# EAGLE design Protoboard MX2-8-7 (EAGLE 7.7.0)
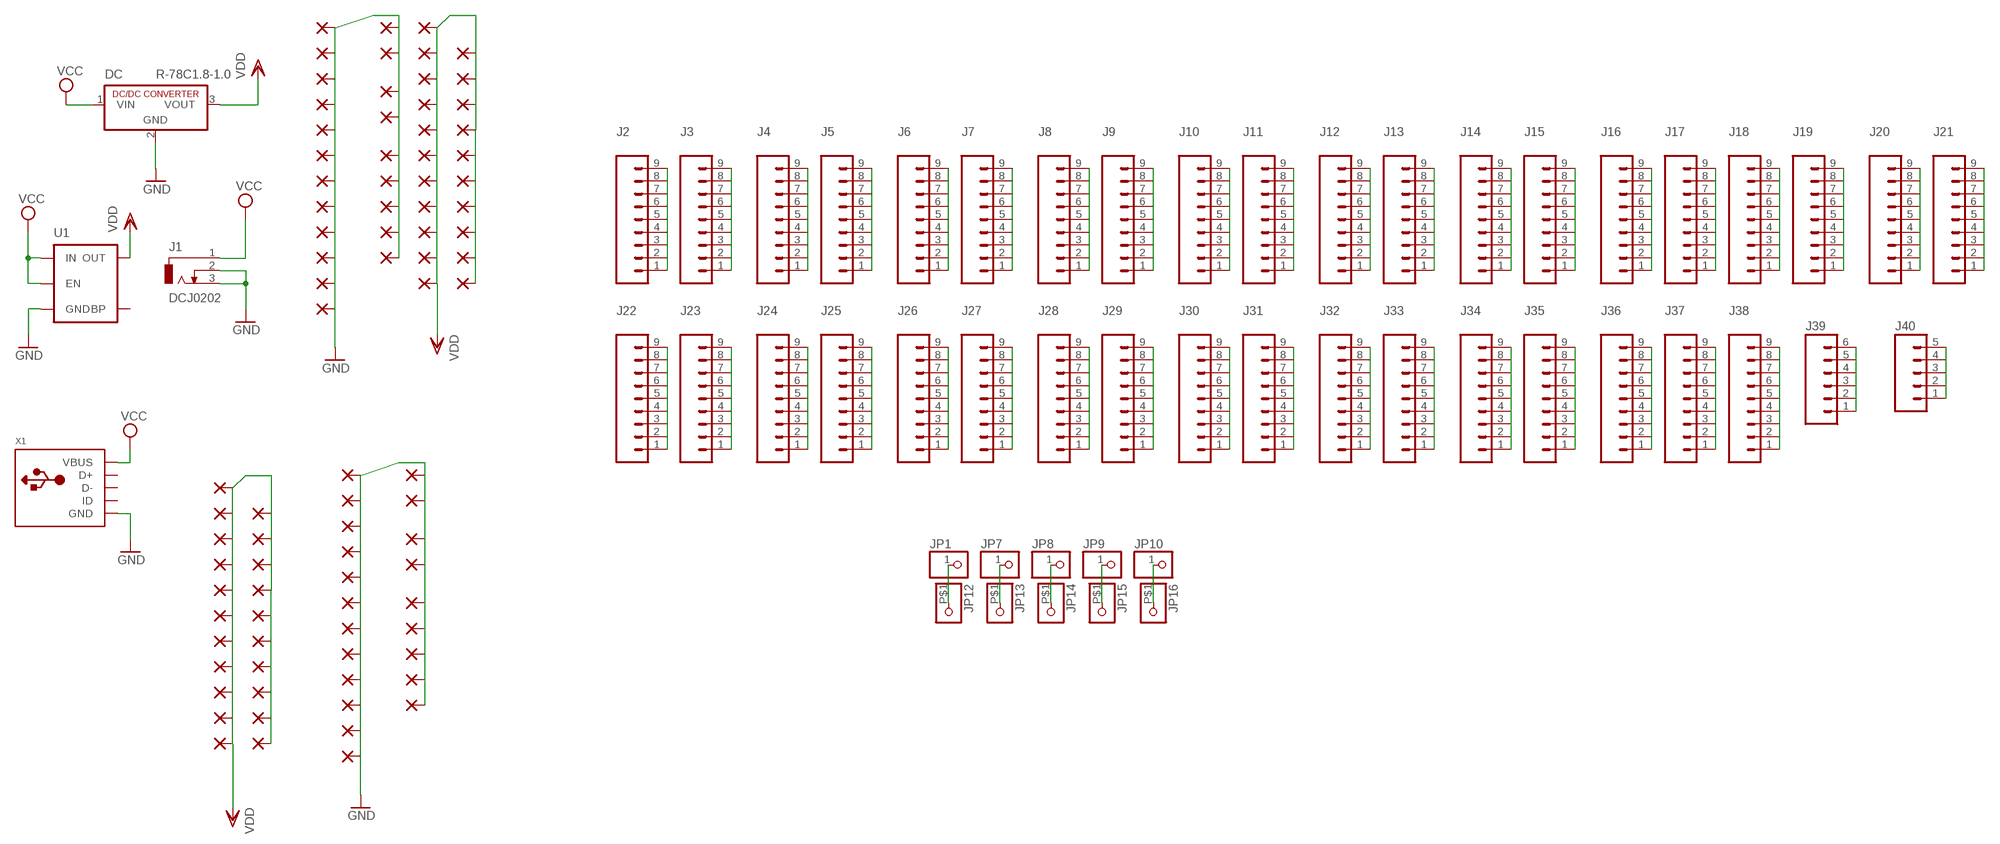
[diagram p0: schematic, sheet 1]

## Parts
DC  R-78C1.8-1.0  [SIP3]
J1  DCJ0202  [DCJ0202]
J2  M09NO_SILK  [1X09_NO_SILK]
J3  M09NO_SILK  [1X09_NO_SILK]
J4  M09NO_SILK  [1X09_NO_SILK]
J5  M09NO_SILK  [1X09_NO_SILK]
J6  M09NO_SILK  [1X09_NO_SILK]
J7  M09NO_SILK  [1X09_NO_SILK]
J8  M09NO_SILK  [1X09_NO_SILK]
J9  M09NO_SILK  [1X09_NO_SILK]
J10  M09NO_SILK  [1X09_NO_SILK]
J11  M09NO_SILK  [1X09_NO_SILK]
J12  M09NO_SILK  [1X09_NO_SILK]
J13  M09NO_SILK  [1X09_NO_SILK]
J14  M09NO_SILK  [1X09_NO_SILK]
J15  M09NO_SILK  [1X09_NO_SILK]
J16  M09NO_SILK  [1X09_NO_SILK]
J17  M09NO_SILK  [1X09_NO_SILK]
J18  M09NO_SILK  [1X09_NO_SILK]
J19  M09NO_SILK  [1X09_NO_SILK]
J20  M09NO_SILK  [1X09_NO_SILK]
J21  M09NO_SILK  [1X09_NO_SILK]
J22  M09NO_SILK  [1X09_NO_SILK]
J23  M09NO_SILK  [1X09_NO_SILK]
J24  M09NO_SILK  [1X09_NO_SILK]
J25  M09NO_SILK  [1X09_NO_SILK]
J26  M09NO_SILK  [1X09_NO_SILK]
J27  M09NO_SILK  [1X09_NO_SILK]
J28  M09NO_SILK  [1X09_NO_SILK]
J29  M09NO_SILK  [1X09_NO_SILK]
J30  M09NO_SILK  [1X09_NO_SILK]
J31  M09NO_SILK  [1X09_NO_SILK]
J32  M09NO_SILK  [1X09_NO_SILK]
J33  M09NO_SILK  [1X09_NO_SILK]
J34  M09NO_SILK  [1X09_NO_SILK]
J35  M09NO_SILK  [1X09_NO_SILK]
J36  M09NO_SILK  [1X09_NO_SILK]
J37  M09NO_SILK  [1X09_NO_SILK]
J38  M09NO_SILK  [1X09_NO_SILK]
J39  M06NO_SILK_FEMALE_PTH  [1X06_NO_SILK]
J40  M05NO_SILK  [1X05_NO_SILK]
JP1  PINHD-1X1CB  [1X01-CLEANBIG]
JP7  PINHD-1X1CB  [1X01-CLEANBIG]
JP8  PINHD-1X1CB  [1X01-CLEANBIG]
JP9  PINHD-1X1CB  [1X01-CLEANBIG]
JP10  PINHD-1X1CB  [1X01-CLEANBIG]
JP12  PINHD-1X1-BIGPOGO  [1X1-BIGPOGO]
JP13  PINHD-1X1-BIGPOGO  [1X1-BIGPOGO]
JP14  PINHD-1X1-BIGPOGO  [1X1-BIGPOGO]
JP15  PINHD-1X1-BIGPOGO  [1X1-BIGPOGO]
JP16  PINHD-1X1-BIGPOGO  [1X1-BIGPOGO]
PAD1  1,6/0,8  [1,6/0,8]
PAD2  1,6/0,8  [1,6/0,8]
PAD3  1,6/0,8  [1,6/0,8]
PAD4  1,6/0,8  [1,6/0,8]
PAD5  1,6/0,8  [1,6/0,8]
PAD6  1,6/0,8  [1,6/0,8]
PAD7  1,6/0,8  [1,6/0,8]
PAD8  1,6/0,8  [1,6/0,8]
PAD9  1,6/0,8  [1,6/0,8]
PAD10  1,6/0,8  [1,6/0,8]
PAD11  1,6/0,8  [1,6/0,8]
PAD12  1,6/0,8  [1,6/0,8]
PAD13  1,6/0,8  [1,6/0,8]
PAD14  1,6/0,8  [1,6/0,8]
PAD15  1,6/0,8  [1,6/0,8]
PAD16  1,6/0,8  [1,6/0,8]
PAD17  1,6/0,8  [1,6/0,8]
PAD18  1,6/0,8  [1,6/0,8]
PAD19  1,6/0,8  [1,6/0,8]
PAD22  1,6/0,8  [1,6/0,8]
PAD23  1,6/0,8  [1,6/0,8]
PAD24  1,6/0,8  [1,6/0,8]
PAD25  1,6/0,8  [1,6/0,8]
PAD26  1,6/0,8  [1,6/0,8]
PAD27  1,6/0,8  [1,6/0,8]
PAD28  1,6/0,8  [1,6/0,8]
PAD29  1,6/0,8  [1,6/0,8]
PAD30  1,6/0,8  [1,6/0,8]
PAD31  1,6/0,8  [1,6/0,8]
PAD32  1,6/0,8  [1,6/0,8]
PAD33  1,6/0,8  [1,6/0,8]
PAD34  1,6/0,8  [1,6/0,8]
PAD35  1,6/0,8  [1,6/0,8]
PAD36  1,6/0,8  [1,6/0,8]
PAD37  1,6/0,8  [1,6/0,8]
PAD39  1,6/0,8  [1,6/0,8]
PAD40  1,6/0,8  [1,6/0,8]
PAD41  1,6/0,8  [1,6/0,8]
PAD43  1,6/0,8  [1,6/0,8]
PAD44  1,6/0,8  [1,6/0,8]
PAD45  1,6/0,8  [1,6/0,8]
PAD46  1,6/0,8  [1,6/0,8]
PAD421  1,6/0,8  [1,6/0,8]
PAD422  1,6/0,8  [1,6/0,8]
PAD423  1,6/0,8  [1,6/0,8]
PAD424  1,6/0,8  [1,6/0,8]
PAD425  1,6/0,8  [1,6/0,8]
PAD426  1,6/0,8  [1,6/0,8]
PAD427  1,6/0,8  [1,6/0,8]
PAD428  1,6/0,8  [1,6/0,8]
PAD429  1,6/0,8  [1,6/0,8]
PAD430  1,6/0,8  [1,6/0,8]
PAD431  1,6/0,8  [1,6/0,8]
PAD432  1,6/0,8  [1,6/0,8]
PAD433  1,6/0,8  [1,6/0,8]
PAD434  1,6/0,8  [1,6/0,8]
PAD435  1,6/0,8  [1,6/0,8]
PAD436  1,6/0,8  [1,6/0,8]
PAD437  1,6/0,8  [1,6/0,8]
PAD438  1,6/0,8  [1,6/0,8]
PAD439  1,6/0,8  [1,6/0,8]
PAD440  1,6/0,8  [1,6/0,8]
PAD441  1,6/0,8  [1,6/0,8]
PAD442  1,6/0,8  [1,6/0,8]
PAD443  1,6/0,8  [1,6/0,8]
PAD444  1,6/0,8  [1,6/0,8]
PAD445  1,6/0,8  [1,6/0,8]
PAD446  1,6/0,8  [1,6/0,8]
PAD447  1,6/0,8  [1,6/0,8]
PAD448  1,6/0,8  [1,6/0,8]
PAD449  1,6/0,8  [1,6/0,8]
PAD450  1,6/0,8  [1,6/0,8]
PAD451  1,6/0,8  [1,6/0,8]
PAD452  1,6/0,8  [1,6/0,8]
PAD453  1,6/0,8  [1,6/0,8]
PAD454  1,6/0,8  [1,6/0,8]
PAD455  1,6/0,8  [1,6/0,8]
PAD456  1,6/0,8  [1,6/0,8]
PAD457  1,6/0,8  [1,6/0,8]
PAD458  1,6/0,8  [1,6/0,8]
PAD459  1,6/0,8  [1,6/0,8]
PAD460  1,6/0,8  [1,6/0,8]
PAD461  1,6/0,8  [1,6/0,8]
PAD462  1,6/0,8  [1,6/0,8]
U1  MIC52053.3V  [SOT23-5]
X1  USB_MICRO_20329_V2  [4UCONN_20329_V2]

## Nets
GND: DC.2(GND) J1.2 J1.3 PAD1.1(P) PAD2.1(P) PAD3.1(P) PAD4.1(P) PAD5.1(P) PAD6.1(P) PAD7.1(P) PAD8.1(P) PAD9.1(P) PAD10.1(P) PAD11.1(P) PAD12.1(P) PAD13.1(P) PAD14.1(P) PAD16.1(P) PAD17.1(P) PAD18.1(P) PAD19.1(P) PAD22.1(P) PAD23.1(P) PAD24.1(P) PAD421.1(P) PAD422.1(P) PAD423.1(P) PAD424.1(P) PAD425.1(P) PAD426.1(P) PAD427.1(P) PAD428.1(P) PAD429.1(P) PAD430.1(P) PAD431.1(P) PAD432.1(P) PAD433.1(P) PAD434.1(P) PAD435.1(P) PAD436.1(P) PAD437.1(P) PAD438.1(P) PAD439.1(P) PAD440.1(P) PAD441.1(P) U1.2(GND) X1.BASE@1(GND) X1.BASE@2(GND) X1.GND X1.SPRT@1(GND) X1.SPRT@2(GND) X1.SPRT@3(GND) X1.SPRT@4(GND)
N$1: J2.1 J2.2 J2.3 J2.4 J2.5 J2.6 J2.7 J2.8 J2.9
N$2: JP1.1 JP12.P$1
N$3: J3.1 J3.2 J3.3 J3.4 J3.5 J3.6 J3.7 J3.8 J3.9
N$4: J4.1 J4.2 J4.3 J4.4 J4.5 J4.6 J4.7 J4.8 J4.9
N$5: J5.1 J5.2 J5.3 J5.4 J5.5 J5.6 J5.7 J5.8 J5.9
N$6: J6.1 J6.2 J6.3 J6.4 J6.5 J6.6 J6.7 J6.8 J6.9
N$7: J7.1 J7.2 J7.3 J7.4 J7.5 J7.6 J7.7 J7.8 J7.9
N$8: J8.1 J8.2 J8.3 J8.4 J8.5 J8.6 J8.7 J8.8 J8.9
N$9: J9.1 J9.2 J9.3 J9.4 J9.5 J9.6 J9.7 J9.8 J9.9
N$10: J10.1 J10.2 J10.3 J10.4 J10.5 J10.6 J10.7 J10.8 J10.9
N$11: J11.1 J11.2 J11.3 J11.4 J11.5 J11.6 J11.7 J11.8 J11.9
N$12: J12.1 J12.2 J12.3 J12.4 J12.5 J12.6 J12.7 J12.8 J12.9
N$13: J13.1 J13.2 J13.3 J13.4 J13.5 J13.6 J13.7 J13.8 J13.9
N$14: J14.1 J14.2 J14.3 J14.4 J14.5 J14.6 J14.7 J14.8 J14.9
N$15: J15.1 J15.2 J15.3 J15.4 J15.5 J15.6 J15.7 J15.8 J15.9
N$16: J16.1 J16.2 J16.3 J16.4 J16.5 J16.6 J16.7 J16.8 J16.9
N$17: J17.1 J17.2 J17.3 J17.4 J17.5 J17.6 J17.7 J17.8 J17.9
N$18: J18.1 J18.2 J18.3 J18.4 J18.5 J18.6 J18.7 J18.8 J18.9
N$19: J19.1 J19.2 J19.3 J19.4 J19.5 J19.6 J19.7 J19.8 J19.9
N$20: J20.1 J20.2 J20.3 J20.4 J20.5 J20.6 J20.7 J20.8 J20.9
N$21: J21.1 J21.2 J21.3 J21.4 J21.5 J21.6 J21.7 J21.8 J21.9
N$22: J22.1 J22.2 J22.3 J22.4 J22.5 J22.6 J22.7 J22.8 J22.9
N$23: J23.1 J23.2 J23.3 J23.4 J23.5 J23.6 J23.7 J23.8 J23.9
N$24: J24.1 J24.2 J24.3 J24.4 J24.5 J24.6 J24.7 J24.8 J24.9
N$25: J25.1 J25.2 J25.3 J25.4 J25.5 J25.6 J25.7 J25.8 J25.9
N$26: J26.1 J26.2 J26.3 J26.4 J26.5 J26.6 J26.7 J26.8 J26.9
N$27: J27.1 J27.2 J27.3 J27.4 J27.5 J27.6 J27.7 J27.8 J27.9
N$28: J28.1 J28.2 J28.3 J28.4 J28.5 J28.6 J28.7 J28.8 J28.9
N$29: J29.1 J29.2 J29.3 J29.4 J29.5 J29.6 J29.7 J29.8 J29.9
N$30: J30.1 J30.2 J30.3 J30.4 J30.5 J30.6 J30.7 J30.8 J30.9
N$31: J31.1 J31.2 J31.3 J31.4 J31.5 J31.6 J31.7 J31.8 J31.9
N$32: J32.1 J32.2 J32.3 J32.4 J32.5 J32.6 J32.7 J32.8 J32.9
N$33: J33.1 J33.2 J33.3 J33.4 J33.5 J33.6 J33.7 J33.8 J33.9
N$34: JP7.1 JP13.P$1
N$35: J34.1 J34.2 J34.3 J34.4 J34.5 J34.6 J34.7 J34.8 J34.9
N$36: J35.1 J35.2 J35.3 J35.4 J35.5 J35.6 J35.7 J35.8 J35.9
N$37: J36.1 J36.2 J36.3 J36.4 J36.5 J36.6 J36.7 J36.8 J36.9
N$38: J37.1 J37.2 J37.3 J37.4 J37.5 J37.6 J37.7 J37.8 J37.9
N$39: J38.1 J38.2 J38.3 J38.4 J38.5 J38.6 J38.7 J38.8 J38.9
N$40: J39.1 J39.2 J39.3 J39.4 J39.5 J39.6
N$41: J40.1 J40.2 J40.3 J40.4 J40.5
N$42: JP8.1 JP14.P$1
N$43: JP9.1 JP15.P$1
N$44: JP10.1 JP16.P$1
VCC: DC.1(VIN) J1.1 U1.1(IN) U1.3(EN) X1.VBUS
VDD: DC.3(VOUT) PAD15.1(P) PAD25.1(P) PAD26.1(P) PAD27.1(P) PAD28.1(P) PAD29.1(P) PAD30.1(P) PAD31.1(P) PAD32.1(P) PAD33.1(P) PAD34.1(P) PAD35.1(P) PAD36.1(P) PAD37.1(P) PAD39.1(P) PAD40.1(P) PAD41.1(P) PAD43.1(P) PAD44.1(P) PAD45.1(P) PAD46.1(P) PAD442.1(P) PAD443.1(P) PAD444.1(P) PAD445.1(P) PAD446.1(P) PAD447.1(P) PAD448.1(P) PAD449.1(P) PAD450.1(P) PAD451.1(P) PAD452.1(P) PAD453.1(P) PAD454.1(P) PAD455.1(P) PAD456.1(P) PAD457.1(P) PAD458.1(P) PAD459.1(P) PAD460.1(P) PAD461.1(P) PAD462.1(P) U1.5(OUT)
Unconnected: U1.4(BP) X1.D+ X1.D- X1.ID

## Library data of the parts
DC = dc-dc-converter:R-78C*-1.0: INNOLINE DC/DC-Converter 1.0 AMP SIP3 Single Output Source: Data sheet <http://www.mikrocontroller.net/attachment/150645/157764-da-01-en-DC_DC_WANDLER_R_78C5_0_1_0.pdf>
J1 = con-jack:DCJ0202: DC POWER JACK Source: DCJ0202.pdf; OC_FARNELL: unknown; OC_NEWARK: unknown
J2-J38 = SparkFun-Connectors:M09: Header 9 Standard 9-pin 0.1" header. Use with straight break away headers (SKU : PRT-00116), right angle break away headers (PRT-00553), swiss pins (PRT-00743), machine pins (PRT-00117), and female headers (PRT-00115).
J39 = SparkFun-Connectors:M06: Header 6 Standard 6-pin 0.1" header. Use with straight break away headers (SKU : PRT-00116), right angle break away headers (PRT-00553), swiss pins (PRT-00743), machine pins (PRT-00117), and female headers (PRT-00115). Molex polarized connector foot print use with SKU : PRT-08094 with associated crimp pins and housings. NOTES ON THE VARIANTS LOCK and LOCK_LONGPADS... This footprint was designed to help hold the alignment of a through-hole component (i.e. 6-pin header) while soldering it into place. You may notice that each hole has been shifted either up or down by 0.005 of an inch from it's more standard position (which is a perfectly straight line). This slight alteration caused the pins (the squares in the middle) to touch the edges of the holes. Because they are alternating, it causes a "brace" to hold the component in place. 0.005 has proven to be the perfect amount of "off-center" position when using our standard breakaway headers. Although looks a little odd when you look at the bare footprint, once you have a header in there, the alteration is very hard to notice. Also,if you push a header all the way into place, it is covered up entirely on the bottom side. This idea of altering the position of holes to aid alignment will be further integrated into the Sparkfun Library for other footprints. It can help hold any component with 3 or more connection pins.; PROD_ID: CONN-08437
J40 = SparkFun-Connectors:M05: Header 5 Standard 5-pin 0.1" header. Use with straight break away headers (SKU : PRT-00116), right angle break away headers (PRT-00553), swiss pins (PRT-00743), machine pins (PRT-00117), and female headers (PRT-00115). Molex polarized connector foot print use with SKU : PRT-08230 with associated crimp pins and housings.
JP1 JP7-JP10 JP12-JP16 = adafruit:PINHD-1X1: Pin header 1x1 for 0.1" spacing With round pins
PAD1-PAD19 PAD22-PAD37 PAD39-PAD41 PAD43-PAD46 PAD421-PAD462 = wirepad:1,6/0,8: THROUGH-HOLE PAD
U1 = SparkFun-PowerIC:MIC5205: MIC5205 150mA vreg 3.3V - VREG-00822 5V - VREG-00823; PROD_ID: VREG-00822
X1 = microbuilder:USB: USB Connectors USBMINIB - Surface Mount Female Mini-B USB Connector 4UConnector: 06564

## Net classes
0 default: width 0.508 mm, drill 0.508 mm, clearance 0.127 mm

## Board
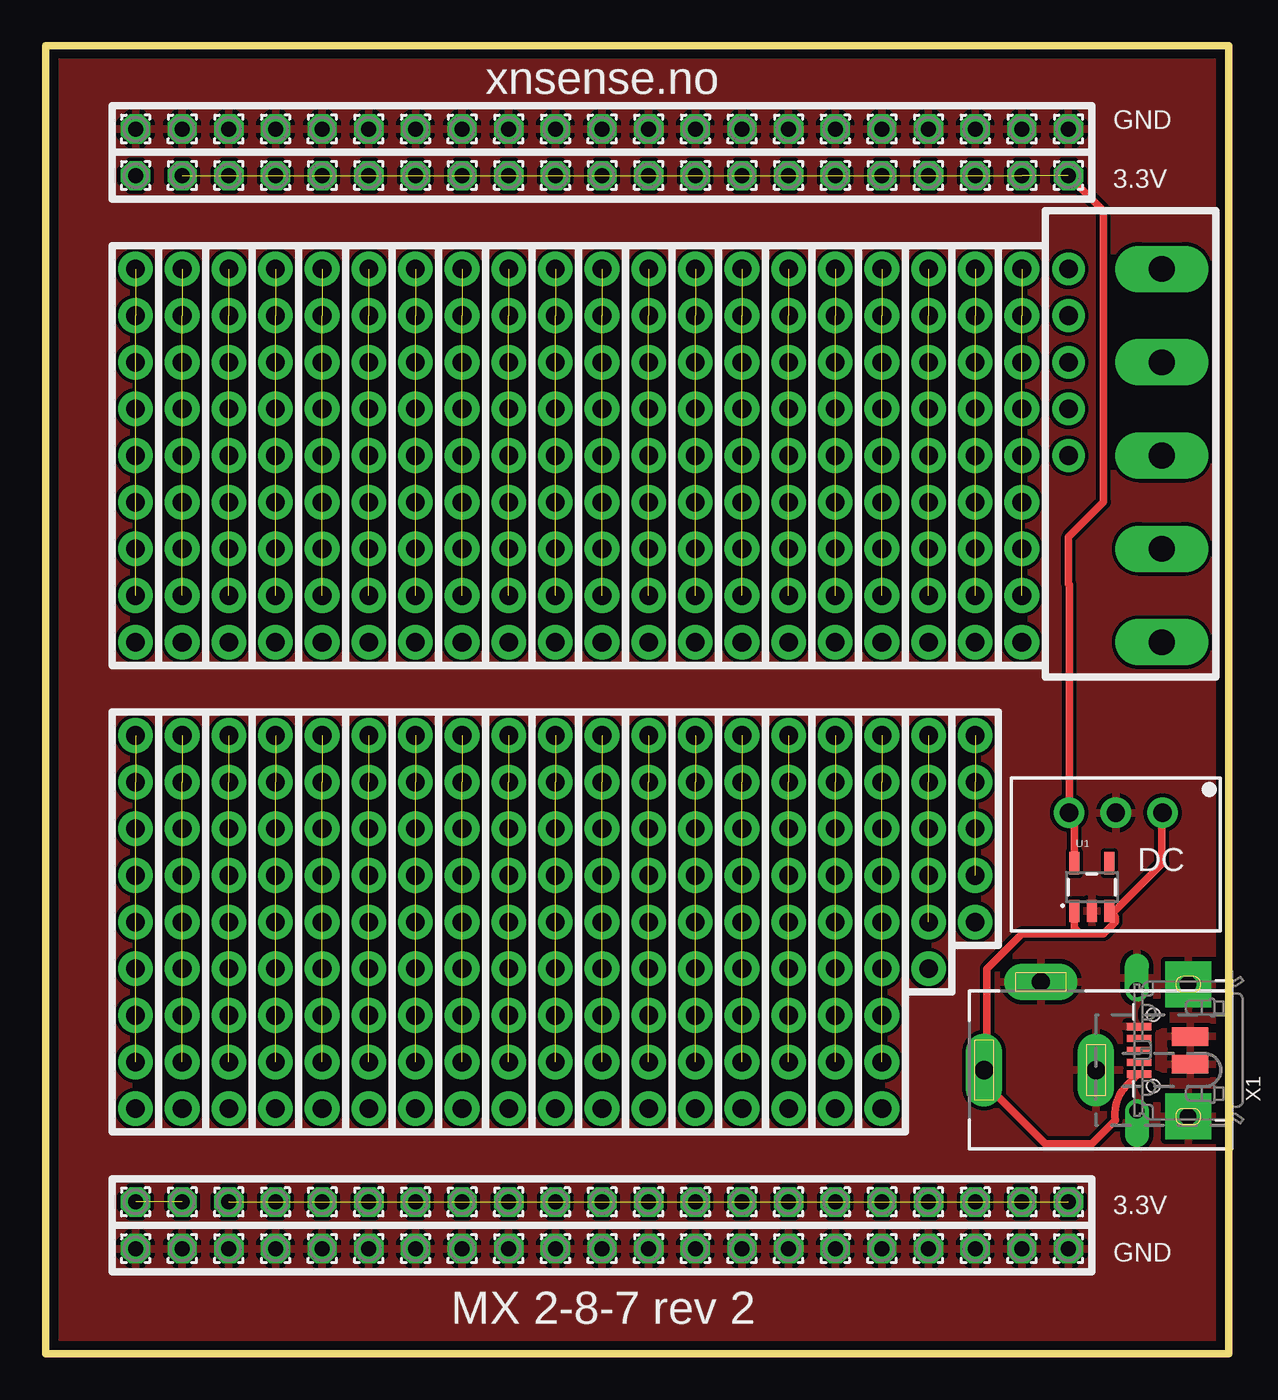
[diagram p1: board, top side]
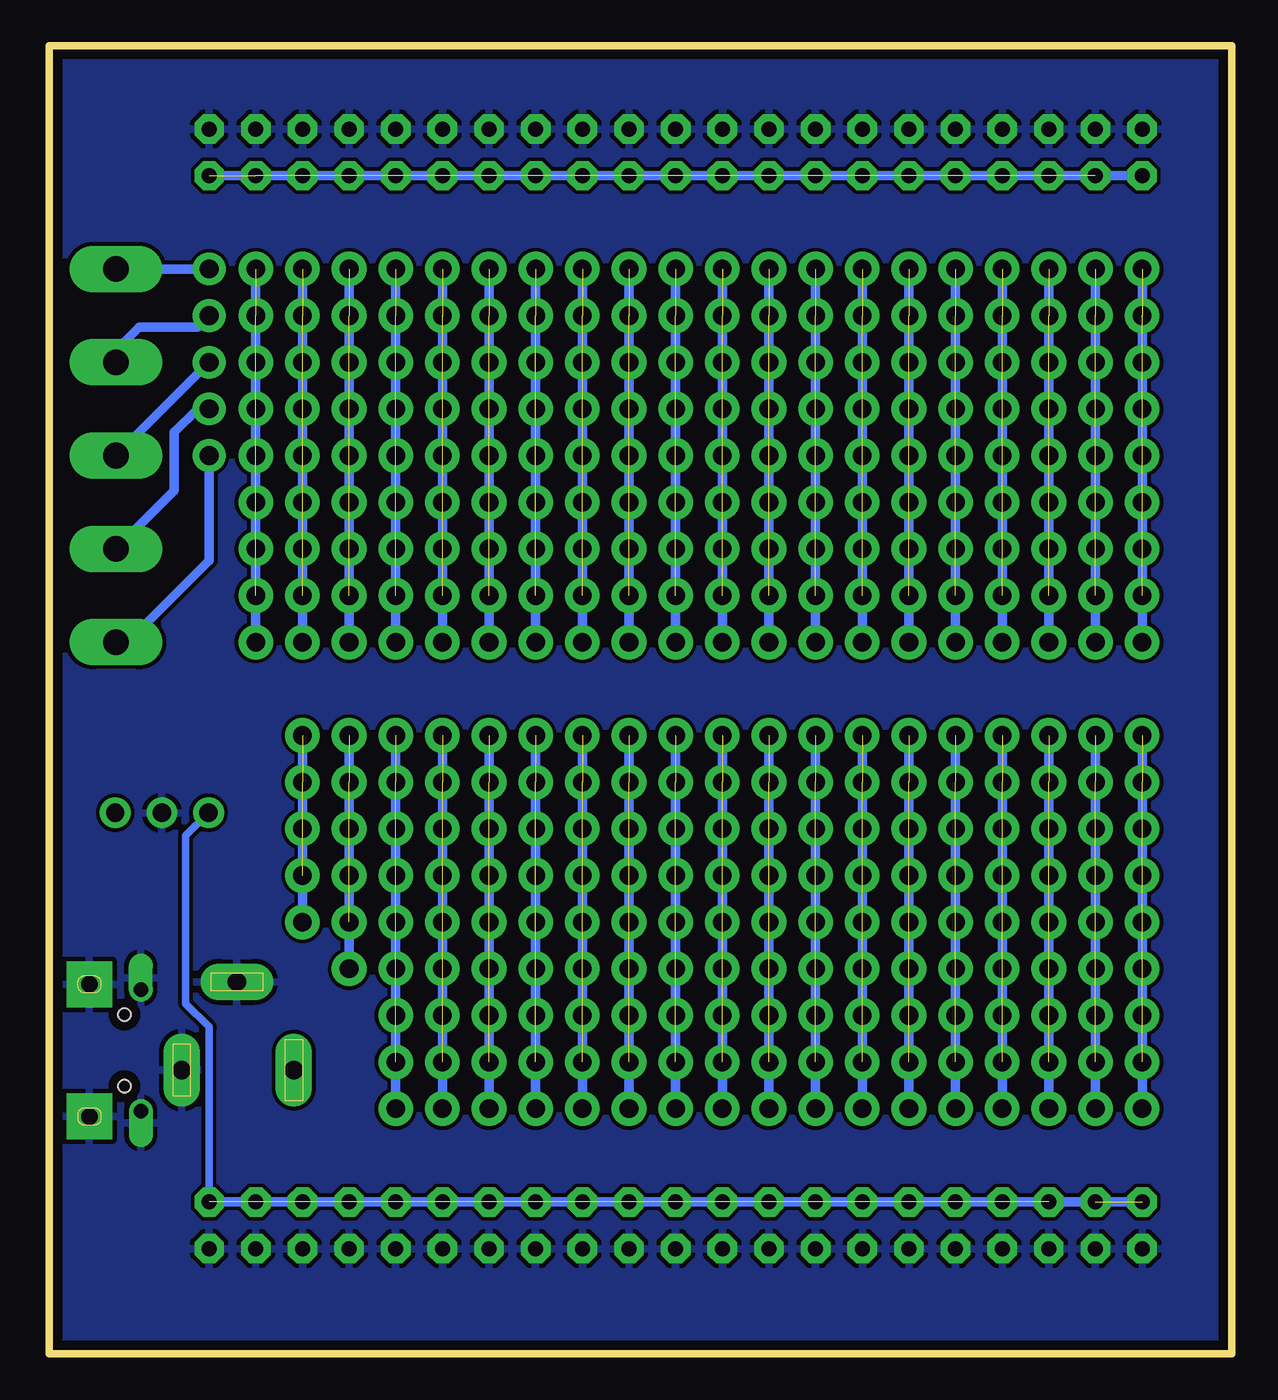
[diagram p2: board, bottom side, seen from below]

Size 64.4 x 71.2 mm. Coordinates in mm from the lower left corner, seen from the top.
Outline: 0,0 0,71.2 64.4,71.2 64.4,0 0,0
Copper layers (1*16): Top 0.035mm / dielectric 1.5mm / Bottom 0.035mm
Design rules "default *": minimum track width 10mil, minimum drill 20mil, track to track 8mil, track to pad 8mil, pad to pad 8mil, via to via 8mil, smd to smd 8mil, copper to edge 20mil, drill to drill 8mil, minimum pad ring 10mil, minimum via ring 8mil, stop-mask expansion 4mil, vias tented up to drill 0mil, thermal gap 10mil

### Footprints (pad centres in the part's own frame; a part is rotated, then mirrored left to right if it is on the bottom)
SIP3 = drill 1 pad 1.676: 1 -2.54,0; 2 0,0; 3 2.54,0
DCJ0202 = drill 1 pad 2 long: 1 0,3.1; 2 4.8,0; 3 0,-3
1X09_NO_SILK = drill 1.016 pad 1.88: 1 0,0; 2 2.54,0; 3 5.08,0; 4 7.62,0; 5 10.16,0; 6 12.7,0; 7 15.24,0; 8 17.78,0; 9 20.32,0
1X06_NO_SILK = drill 1.016 pad 1.88: 1 0,0; 2 2.54,0; 3 5.08,0; 4 7.62,0; 5 10.16,0; 6 12.7,0
1X05_NO_SILK = drill 1.016 pad 1.88: 1 0,0; 2 2.54,0; 3 5.08,0; 4 7.62,0; 5 10.16,0
1X01-CLEANBIG = drill 1.016 pad 1.778: 1 0,0
1X1-BIGPOGO = drill 1.4 pad 2.54 long: P$1 0,0
1,6/0,8 = drill 0.813 pad 1.6 octagon: 1 0,0
SOT23-5 = smd 0.55 x 1.2: 1 -0.95,-1.3; 2 0,-1.3; 3 0.95,-1.3; 4 0.95,1.3; 5 -0.95,1.3
4UCONN_20329_V2 = smd 1 x 2: BASE@1 -0.75,-2; BASE@2 0.75,-2 | smd 0.4 x 1.35: D+ 0,0.775; D- -0.65,0.775; GND 1.3,0.775; ID 0.65,0.775; VBUS -1.3,0.775 | drill 0.8 pad 1.2 offset: SPRT@1 -3.3,0.9; SPRT@2 3.3,0.9 | drill 0.9 pad 2.5 square: SPRT@3 -3.6,-1.9; SPRT@4 3.6,-1.9 | hole 0.7: -1.95,0; 1.95,0

### Placement (x,y rotation side)
DC  58.25,29.45 180 top
J1  54.17,15.44 90 top
J2  4.88,38.73 90 top
J3  7.42,38.73 90 top
J4  9.96,38.73 90 top
J5  12.5,38.73 90 top
J6  15.04,38.73 90 top
J7  17.58,38.73 90 top
J8  20.12,38.73 90 top
J9  22.66,38.73 90 top
J10  25.2,38.73 90 top
J11  27.74,38.73 90 top
J12  30.28,38.73 90 top
J13  32.82,38.73 90 top
J14  35.36,38.73 90 top
J15  37.9,38.73 90 top
J16  40.44,38.73 90 top
J17  42.98,38.73 90 top
J18  45.52,38.73 90 top
J19  48.06,38.73 90 top
J20  50.6,38.73 90 top
J21  53.14,38.73 90 top
J22  4.88,13.34 90 top
J23  7.42,13.34 90 top
J24  9.96,13.34 90 top
J25  12.5,13.34 90 top
J26  15.04,13.34 90 top
J27  17.58,13.34 90 top
J28  20.12,13.34 90 top
J29  22.66,13.34 90 top
J30  25.2,13.34 90 top
J31  27.74,13.34 90 top
J32  30.28,13.34 90 top
J33  32.82,13.34 90 top
J34  35.36,13.34 90 top
J35  37.9,13.34 90 top
J36  40.44,13.34 90 top
J37  42.98,13.34 90 top
J38  45.52,13.34 90 top
J39  48.06,20.95 90 top
J40  50.6,23.5 90 top
JP1  55.68,59.05 0 top
JP7  55.68,56.52 0 top
JP8  55.68,53.98 0 top
JP9  55.68,51.44 0 top
JP10  55.68,48.9 0 top
JP12  60.76,59.05 0 top
JP13  60.76,53.98 0 top
JP14  60.76,48.9 0 top
JP15  60.76,43.81 0 top
JP16  60.76,38.73 0 top
PAD1  37.9,66.67 0 top
PAD2  4.88,66.67 0 top
PAD3  32.82,66.67 0 top
PAD4  7.42,66.67 0 top
PAD5  30.28,66.67 0 top
PAD6  9.96,66.67 0 top
PAD7  27.74,66.67 0 top
PAD8  12.5,66.67 0 top
PAD9  25.2,66.67 0 top
PAD10  22.66,66.67 0 top
PAD11  15.04,66.67 0 top
PAD12  17.58,66.67 0 top
PAD13  20.12,66.67 0 top
PAD14  45.52,66.67 0 top
PAD15  55.68,64.14 0 top
PAD16  48.06,66.67 0 top
PAD17  42.98,66.67 0 top
PAD18  50.6,66.67 0 top
PAD19  40.44,66.67 0 top
PAD22  55.68,66.67 0 top
PAD23  53.14,66.67 0 top
PAD24  35.36,66.67 0 top
PAD25  4.88,64.14 0 top
PAD26  7.42,64.14 0 top
PAD27  30.28,64.14 0 top
PAD28  25.2,64.14 0 top
PAD29  27.74,64.14 0 top
PAD30  15.04,64.14 0 top
PAD31  12.5,64.14 0 top
PAD32  9.96,64.14 0 top
PAD33  17.58,64.14 0 top
PAD34  32.82,64.14 0 top
PAD35  35.36,64.14 0 top
PAD36  20.12,64.14 0 top
PAD37  42.98,64.14 0 top
PAD39  22.66,64.14 0 top
PAD40  50.6,64.14 0 top
PAD41  53.14,64.14 0 top
PAD43  40.44,64.14 0 top
PAD44  37.9,64.14 0 top
PAD45  48.06,64.14 0 top
PAD46  45.52,64.14 0 top
PAD421  4.88,5.71 0 top
PAD422  55.68,5.71 0 top
PAD423  12.5,5.71 0 top
PAD424  7.42,5.71 0 top
PAD425  53.14,5.71 0 top
PAD426  15.04,5.71 0 top
PAD427  9.96,5.71 0 top
PAD428  50.6,5.71 0 top
PAD429  17.58,5.71 0 top
PAD430  37.9,5.71 0 top
PAD431  48.06,5.71 0 top
PAD432  20.12,5.71 0 top
PAD433  40.44,5.71 0 top
PAD434  45.52,5.71 0 top
PAD435  22.66,5.71 0 top
PAD436  35.36,5.71 0 top
PAD437  42.98,5.71 0 top
PAD438  25.2,5.71 0 top
PAD439  32.82,5.71 0 top
PAD440  30.28,5.71 0 top
PAD441  27.74,5.71 0 top
PAD442  55.68,8.26 0 top
PAD443  40.44,8.26 0 top
PAD444  4.88,8.26 0 top
PAD445  53.14,8.26 0 top
PAD446  37.9,8.26 0 top
PAD447  7.42,8.26 0 top
PAD448  50.6,8.26 0 top
PAD449  35.36,8.26 0 top
PAD450  9.96,8.26 0 top
PAD451  48.06,8.26 0 top
PAD452  32.82,8.26 0 top
PAD453  12.5,8.26 0 top
PAD454  45.52,8.26 0 top
PAD455  30.28,8.26 0 top
PAD456  15.04,8.26 0 top
PAD457  42.98,8.26 0 top
PAD458  27.74,8.26 0 top
PAD459  17.58,8.26 0 top
PAD460  25.2,8.26 0 top
PAD461  22.66,8.26 0 top
PAD462  20.12,8.26 0 top
U1  56.95,25.4 0 top
X1  60.3,16.51 90 top

### Tracks (layer width: path | path; a pad name or v marks a point on that pad's centre or on a via)
GND
  pour Top: 0,71.2 0,0 64.4,0 64.4,71.2
  pour Bottom: 0,71.2 64.4,71.2 64.4,0 0,0
N$1  (7 unrouted)
  Bottom 0.508: J2.9 J2.1
N$2
  Bottom 0.508: JP1.1 JP12.P$1
N$3  (7 unrouted)
  Bottom 0.508: J3.9 J3.1
N$4  (7 unrouted)
  Bottom 0.508: J4.9 J4.1
N$5  (7 unrouted)
  Bottom 0.508: J5.9 J5.1
N$6  (7 unrouted)
  Bottom 0.508: J6.9 J6.1
N$7  (7 unrouted)
  Bottom 0.508: J7.1 J7.9
N$8  (7 unrouted)
  Bottom 0.508: J8.9 J8.1
N$9  (7 unrouted)
  Bottom 0.508: J9.1 J9.9
N$10  (7 unrouted)
  Bottom 0.508: J10.9 J10.1
N$11  (7 unrouted)
  Bottom 0.508: J11.1 J11.9
N$12  (7 unrouted)
  Bottom 0.508: J12.9 J12.1
N$13  (7 unrouted)
  Bottom 0.508: J13.1 J13.9
N$14  (7 unrouted)
  Bottom 0.508: J14.9 J14.1
N$15  (7 unrouted)
  Bottom 0.508: J15.1 J15.9
N$16  (7 unrouted)
  Bottom 0.508: J16.9 J16.1
N$17  (7 unrouted)
  Bottom 0.508: J17.1 J17.9
N$18  (7 unrouted)
  Bottom 0.508: J18.9 J18.1
N$19  (7 unrouted)
  Bottom 0.508: J19.1 J19.9
N$20  (7 unrouted)
  Bottom 0.508: J20.9 J20.1
N$21  (7 unrouted)
  Bottom 0.508: J21.1 J21.9
N$22  (7 unrouted)
  Bottom 0.508: J22.9 J22.1
N$23  (7 unrouted)
  Bottom 0.508: J23.1 J23.9
N$24  (7 unrouted)
  Bottom 0.508: J24.9 J24.1
N$25  (7 unrouted)
  Bottom 0.508: J25.1 J25.9
N$26  (7 unrouted)
  Bottom 0.508: J26.9 J26.1
N$27  (7 unrouted)
  Bottom 0.508: J27.1 J27.9
N$28  (7 unrouted)
  Bottom 0.508: J28.9 J28.1
N$29  (7 unrouted)
  Bottom 0.508: J29.1 J29.9
N$30  (7 unrouted)
  Bottom 0.508: J30.9 J30.1
N$31  (7 unrouted)
  Bottom 0.508: J31.1 J31.9
N$32  (7 unrouted)
  Bottom 0.508: J32.9 J32.1
N$33  (7 unrouted)
  Bottom 0.508: J33.1 J33.9
N$34
  Bottom 0.508: JP13.P$1 60.76,54.61 59.49,55.88 56.31,55.88 JP7.1
N$35  (7 unrouted)
  Bottom 0.508: J34.9 J34.1
N$36  (7 unrouted)
  Bottom 0.508: J35.1 J35.9
N$37  (7 unrouted)
  Bottom 0.508: J36.9 J36.1
N$38  (7 unrouted)
  Bottom 0.508: J37.1 J37.9
N$39  (7 unrouted)
  Bottom 0.508: J38.9 J38.1
N$40  (4 unrouted)
  Bottom 0.508: J39.1 J39.6
N$41  (3 unrouted)
  Bottom 0.508: J40.5 J40.1
N$42
  Bottom 0.508: JP14.P$1 JP8.1
N$43
  Bottom 0.508: JP9.1 56.31,51.44 57.58,50.16 57.58,46.99 JP15.P$1
N$44
  Bottom 0.508: JP10.1 55.68,43.18 59.49,39.37 60.12,39.37 JP16.P$1
VCC
  Top 0.406: X1.VBUS 59.46,15.21 58.85,14.61 arc53 58.22,12.7 56.95,11.43 54.41,11.43 50.6,15.24 50.88,15.24 J1.1 51.23,15.6 51.23,20.95 53.14,22.86 56.31,22.86 | U1.1 56,23.18 56.31,22.86 | DC.1 60.76,29.41 60.76,26.67 58.19,24.1 U1.3 58.22,23.78 58.22,23.5 57.58,22.86 56.31,22.86
VDD  (38 unrouted)
  Top 0.406: U1.5 56,29.16 DC.3 55.71,41.88 55.68,41.91 55.68,44.45 57.58,46.35 57.58,62.23 PAD15.1
  Bottom 0.406: PAD442.1 55.68,17.78 56.95,19.05 56.95,28.21 DC.3
  Bottom 0.508: PAD25.1 PAD15.1 | PAD444.1 PAD442.1

### Text on the board
tNames: xnsense.no | GND | 3.3V | 3.3V | GND | MX 2-8-7 rev 2